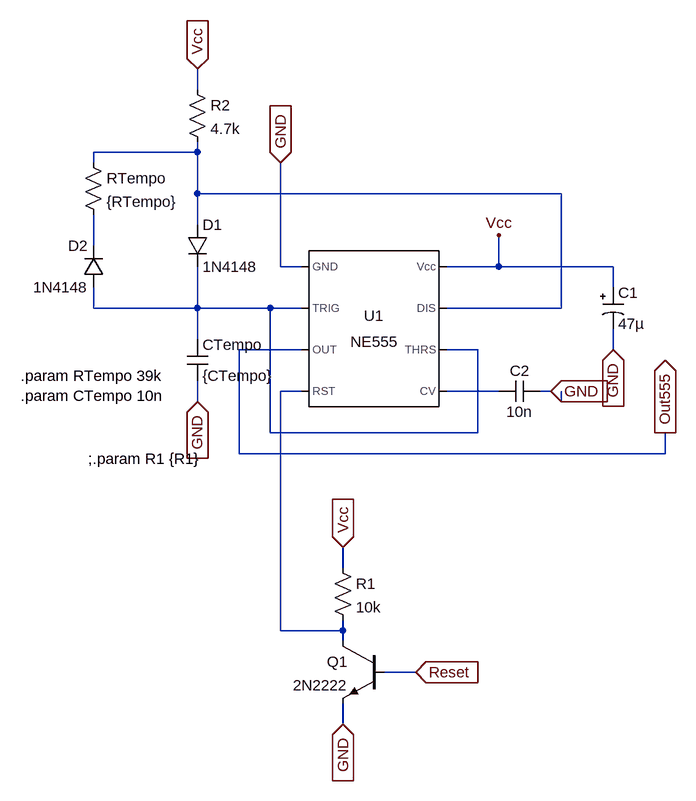
[diagram p0: schematic Mod1_555.asc]
Mod1_555.asc, the LTspice schematic file:
Version 4.1
SHEET 1 1100 928
WIRE -160 -160 -160 -192
WIRE -160 -64 -160 -80
WIRE -160 -64 -320 -64
WIRE -320 -48 -320 -64
WIRE -160 0 -160 -64
WIRE 400 0 -160 0
WIRE -160 48 -160 0
WIRE -320 80 -320 32
WIRE -32 112 -32 -48
WIRE 0 112 -32 112
WIRE 304 112 304 64
WIRE 304 112 224 112
WIRE 480 112 304 112
WIRE 480 144 480 112
WIRE -320 176 -320 144
WIRE -160 176 -160 112
WIRE -160 176 -320 176
WIRE -48 176 -160 176
WIRE 0 176 -48 176
WIRE 400 176 400 0
WIRE 400 176 224 176
WIRE -160 224 -160 176
WIRE 0 240 -96 240
WIRE 272 240 224 240
WIRE 480 240 480 208
WIRE 0 304 -32 304
WIRE 304 304 224 304
WIRE 384 304 368 304
WIRE -160 320 -160 288
WIRE 400 320 400 304
WIRE -48 368 -48 176
WIRE 272 368 272 240
WIRE 272 368 -48 368
WIRE -96 400 -96 240
WIRE 560 400 560 368
WIRE 560 400 -96 400
WIRE 64 576 64 544
WIRE -32 672 -32 304
WIRE 64 672 64 656
WIRE 64 672 -32 672
WIRE 64 688 64 672
WIRE 176 736 128 736
WIRE 64 816 64 784
FLAG 304 64 Vcc
FLAG 560 368 Out555
IOPIN 560 368 Out
FLAG -160 -192 Vcc
IOPIN -160 -192 In
FLAG 480 240 GND
IOPIN 480 240 In
FLAG 384 304 GND
IOPIN 384 304 In
FLAG -32 -48 GND
IOPIN -32 -48 In
FLAG -160 320 GND
IOPIN -160 320 In
FLAG 64 544 Vcc
IOPIN 64 544 In
FLAG 64 816 GND
IOPIN 64 816 In
FLAG 176 736 Reset
IOPIN 176 736 In
SYMBOL Misc\\NE555 112 208 R0
SYMATTR InstName U1
SYMBOL polcap 464 144 R0
SYMATTR InstName C1
SYMATTR Value 47µ
SYMBOL cap 368 288 R90
WINDOW 0 0 32 VBottom 2
WINDOW 3 32 32 VTop 2
SYMATTR InstName C2
SYMATTR Value 10n
SYMBOL diode -176 48 R0
SYMATTR InstName D1
SYMATTR Value 1N4148
SYMBOL diode -304 144 R180
WINDOW 0 24 64 Left 2
WINDOW 3 24 0 Left 2
SYMATTR InstName D2
SYMATTR Value 1N4148
SYMBOL res -336 -64 R0
SYMATTR InstName RTempo
SYMATTR Value {RTempo}
SYMBOL res -176 -176 R0
SYMATTR InstName R2
SYMATTR Value 4.7k
SYMBOL cap -176 224 R0
SYMATTR InstName CTempo
SYMATTR Value {CTempo}
SYMBOL npn 128 688 M0
SYMATTR InstName Q1
SYMATTR Value 2N2222
SYMBOL res 48 560 R0
SYMATTR InstName R1
SYMATTR Value 10k
TEXT -328 408 Left 2 !;.param R1 {R1}
TEXT -432 280 Left 2 !.param RTempo 39k\n.param CTempo 10n

The netlist it stands for:
* Mod1_555.asc
X§U1 GND N003 Out555 N004 N005 N003 N001 Vcc NE555  ; pins GND TRIG OUT RST CV THRS DIS Vcc
C1 Vcc GND 47µ
C2 GND N005 10n
D1 N001 N003 1N4148
D2 N003 N002 1N4148
RTempo N001 N002 {RTempo}
R2 Vcc N001 4.7k
CTempo N003 GND {CTempo}
Q1 N004 Reset GND 0 2N2222
R1 Vcc N004 10k
.model D D
.lib standard.dio
.model NPN NPN
.model PNP PNP
.lib standard.bjt
;.param R1 {R1}
.param RTempo 39k
.param CTempo 10n
.lib NE555.sub
.backanno
.end